# Altium schematic sheet USB-C-PCB.SchDoc
size A4
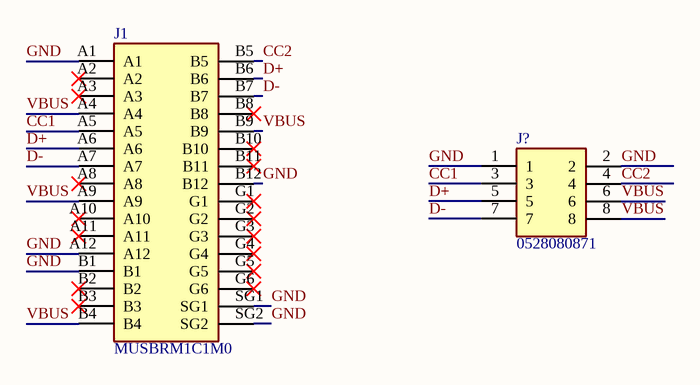
[diagram p0: USB-C-PCB.SchDoc]

## Parts
J1  MUSBRM1C1M0  [MUSBRM1C1M0]
J?  0528080871  [0528080871]

## Nets
CC1: J1.A5 J?.3
CC2: J1.B5 J?.4
D+: J1.A6 J1.B6 J?.5
D-: J1.A7 J1.B7 J?.7
GND: J1.A1 J1.A12 J1.B1 J1.B12 J1.SG1 J1.SG2 J?.1 J?.2
VBUS: J1.A4 J1.A9 J1.B4 J1.B9 J?.6 J?.8

Not connected (* = marked no-connect by the designer): J1 A2* A3* A8* A10* A11* B2* B3* B8* B10* B11* G1* G2* G3* G4* G5* G6*

## Library data of the parts
J1 = MUSBRM1C1M0: Connector; Manufacturer_Name: Amphenol; Datasheet Link: http://www.amphenol-icc.com/media/wysiwyg/files/drawing/musbrm1c1xx.pdf; Height: 6.15mm; Manufacturer_Part_Number: MUSBRM1C1M0; Mouser Part Number: 523-MUSBRM1C1M0; Mouser Price/Stock: https://www.mouser.co.uk/ProductDetail/Amphenol-Commercial-Products/MUSBRM1C1M0?qs=z4I1WACWgPTQVfMzr4eSOQ%3D%3D; Arrow Part Number: MUSBRM1C1M0; Arrow Price/Stock: https://www.arrow.com/en/products/musbrm1c1m0/amphenol-fci?region=europe
J? = 0528080871: Connector; Manufacturer_Name: Molex; Datasheet Link: https://www.molex.com/pdm_docs/sd/528080871_sd.pdf; Height: 5.3mm; Manufacturer_Part_Number: 0528080871; Arrow Part Number: 0528080871; Arrow Price/Stock: https://www.arrow.com/en/products/0528080871/molex